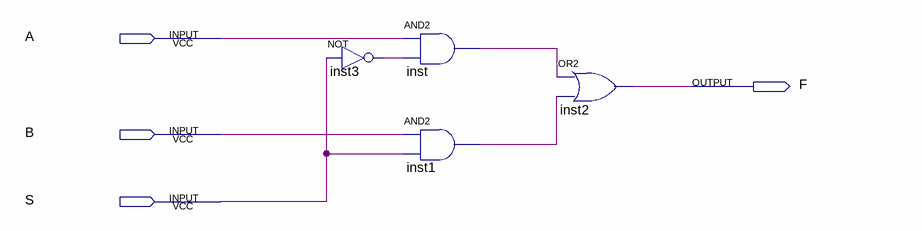
[diagram p0: schematic sheet]
// Quartus schematic MUX.bdf as structural Verilog: 4 symbols, 4 pins
module MUX (
  input  A,
  input  B,
  input  S,
  output F
);

  wire inst1_out, inst3_out, inst_out;

  not inst3 (inst3_out, S);
  and inst (inst_out, A, inst3_out);
  and inst1 (inst1_out, B, S);
  or inst2 (F, inst_out, inst1_out);
endmodule
